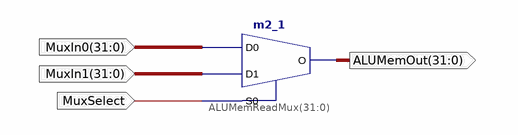
[diagram p0: schematic sheet 1]
// Xilinx ISE schematic Mux32_TwoIn.sch (xa9500xl) as structural Verilog: 1 symbols, 4 ports
module Mux32_TwoIn (
  input  MuxSelect,
  input  [31:0] MuxIn1,
  input  [31:0] MuxIn0,
  output [31:0] ALUMemOut
);

  m2_1 ALUMemReadMux[31:0] (.D0(MuxIn0), .D1(MuxIn1), .S0(MuxSelect), .O(ALUMemOut));
endmodule
